# Altium schematic sheet Master.SchDoc: PDM
size A3; SheetNumber: 1; SheetTotal: 6
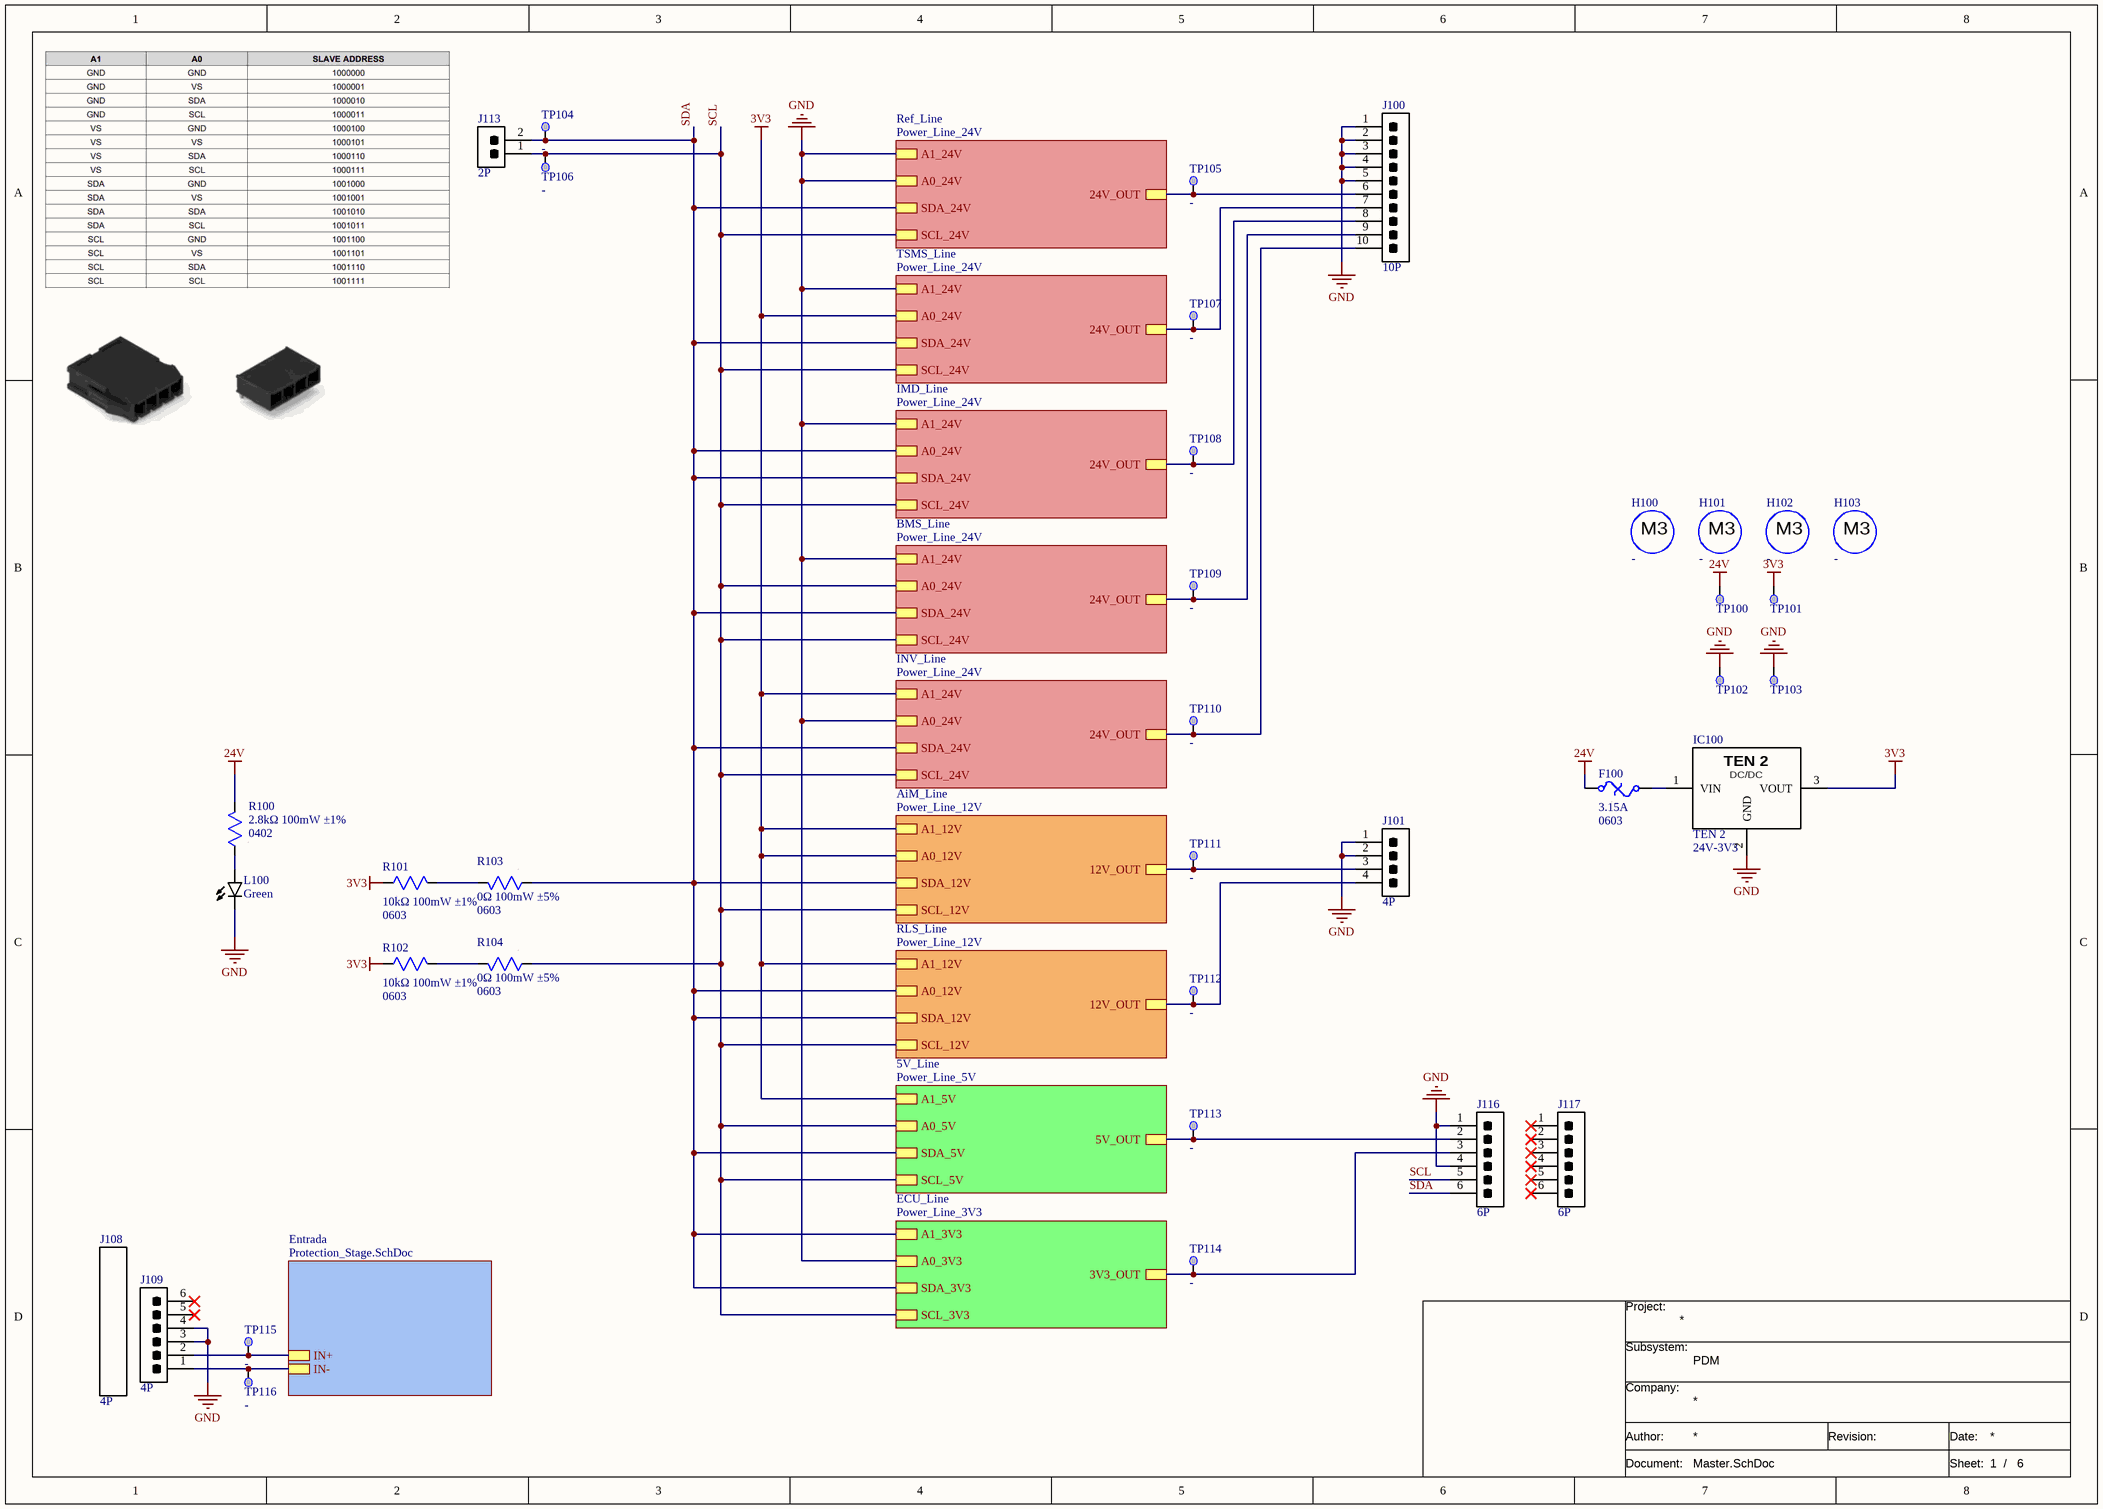
[diagram p0: Master.SchDoc]

## Parts
F100  value 3.15A  Package: 0603  [FUSE SMD 0603]  (hidden comment: FUSE)
H100  SCREW M3  [M3]  (value not drawn)
H101  SCREW M3  [M3]  (value not drawn)
H102  SCREW M3  [M3]  (value not drawn)
H103  SCREW M3  [M3]  (value not drawn)
IC100  TEN 2  value 24V-3V3  [TEN 2]
J100  value 10P  [657010240101]  (hidden comment: CONN 10P)
J101  value 4P  [657004240101]  (hidden comment: CONN 4P)
J108  value 4P  [657004150201]  (hidden comment: AEREO)
J109  value 4P  [657004140101]  (hidden comment: CONN 6P)
J113  value 2P  [PIN_HEADER_THT_2P]  (hidden comment: CONN 2P)
J116  value 6P  [HEADERS_MALE_6P_2.54MM]  (hidden comment: CONN 6P)
J117  value 6P  [HEADERS_MALE_6P_2.54MM]  (hidden comment: CONN 6P)
L100  value Green  [LED SMD 0603]  (hidden comment: LED WHITE)
R100  value 2.8kΩ 100mW ±1%  Package: 0402  [RES SMD 0402]  (hidden comment: RES)
R101  value 10kΩ 100mW ±1%  Package: 0603  [RES SMD 0603]  (hidden comment: RES)
R102  value 10kΩ 100mW ±1%  Package: 0603  [RES SMD 0603]  (hidden comment: RES)
R103  value 0Ω 100mW ±5%  Package: 0603  [RES SMD 0603]  (hidden comment: RES)
R104  value 0Ω 100mW ±5%  Package: 0603  [RES SMD 0603]  (hidden comment: RES)
TP100  Test Point  [TP_THT_1.5MM]  (value not drawn)  (no BOM)
TP101  Test Point  [TP_THT_1.5MM]  (value not drawn)  (no BOM)
TP102  Test Point  [TP_THT_1.5MM]  (value not drawn)  (no BOM)
TP103  Test Point  [TP_THT_1.5MM]  (value not drawn)  (no BOM)
TP104  Test Point  [TP_SMD_1MM]  (value not drawn)  (no BOM)
TP105  Test Point  [TP_SMD_1MM]  (value not drawn)  (no BOM)
TP106  Test Point  [TP_SMD_1MM]  (value not drawn)  (no BOM)
TP107  Test Point  [TP_SMD_1MM]  (value not drawn)  (no BOM)
TP108  Test Point  [TP_SMD_1MM]  (value not drawn)  (no BOM)
TP109  Test Point  [TP_SMD_1MM]  (value not drawn)  (no BOM)
TP110  Test Point  [TP_SMD_1MM]  (value not drawn)  (no BOM)
TP111  Test Point  [TP_SMD_1MM]  (value not drawn)  (no BOM)
TP112  Test Point  [TP_SMD_1MM]  (value not drawn)  (no BOM)
TP113  Test Point  [TP_SMD_1MM]  (value not drawn)  (no BOM)
TP114  Test Point  [TP_SMD_1MM]  (value not drawn)  (no BOM)
TP115  Test Point  [TP_SMD_1MM]  (value not drawn)  (no BOM)
TP116  Test Point  [TP_SMD_1MM]  (value not drawn)  (no BOM)

## Sub-sheets
5V_Line = Power_Line_5V: 5V_OUT, A1_5V, A0_5V, SDA_5V, SCL_5V
AiM_Line = Power_Line_12V: 12V_OUT, A1_12V, A0_12V, SDA_12V, SCL_12V
BMS_Line = Power_Line_24V: A1_24V, A0_24V, SDA_24V, SCL_24V, 24V_OUT
ECU_Line = Power_Line_3V3: 3V3_OUT, A1_3V3, A0_3V3, SDA_3V3, SCL_3V3
Entrada = Protection_Stage.SchDoc: IN-, IN+
IMD_Line = Power_Line_24V: A1_24V, A0_24V, SDA_24V, SCL_24V, 24V_OUT
INV_Line = Power_Line_24V: A1_24V, A0_24V, SDA_24V, SCL_24V, 24V_OUT
Ref_Line = Power_Line_24V: A1_24V, A0_24V, SDA_24V, SCL_24V, 24V_OUT
RLS_Line = Power_Line_12V: 12V_OUT, A1_12V, A0_12V, SDA_12V, SCL_12V
TSMS_Line = Power_Line_24V: A1_24V, A0_24V, SDA_24V, SCL_24V, 24V_OUT

## Nets
3V3: IC100.3(VOUT) R101.1 R102.1 TP101.1 ; sheet 5V_Line/A1_5V, sheet RLS_Line/A1_12V, sheet AiM_Line/A1_12V, sheet AiM_Line/A0_12V, sheet INV_Line/A1_24V, sheet TSMS_Line/A0_24V
24V: F100.1 R100.2 TP100.1
GND: IC100.2(GND) J100.1 J100.2 J100.3 J100.4 J100.5 J101.1 J101.2 J109.3 J109.4 J116.1 J116.4 L100.C TP102.1 TP103.1 ; sheet ECU_Line/A0_3V3, sheet Ref_Line/A1_24V, sheet Ref_Line/A0_24V, sheet IMD_Line/A1_24V, sheet BMS_Line/A1_24V, sheet INV_Line/A0_24V, sheet TSMS_Line/A1_24V
SCL: J113.1 J116.5 R104.1 TP106.1 ; sheet ECU_Line/SCL_3V3, sheet 5V_Line/A0_5V, sheet 5V_Line/SCL_5V, sheet RLS_Line/SCL_12V, sheet AiM_Line/SCL_12V, sheet Ref_Line/SCL_24V, sheet IMD_Line/SCL_24V, sheet BMS_Line/A0_24V, sheet BMS_Line/SCL_24V, sheet INV_Line/SCL_24V, sheet TSMS_Line/SCL_24V
SDA: J113.2 J116.6 R103.1 TP104.1 ; sheet ECU_Line/A1_3V3, sheet ECU_Line/SDA_3V3, sheet 5V_Line/SDA_5V, sheet RLS_Line/A0_12V, sheet RLS_Line/SDA_12V, sheet AiM_Line/SDA_12V, sheet Ref_Line/SDA_24V, sheet IMD_Line/A0_24V, sheet IMD_Line/SDA_24V, sheet BMS_Line/SDA_24V, sheet INV_Line/SDA_24V, sheet TSMS_Line/SDA_24V
NetF100_2: F100.2 IC100.1(VIN)
NetJ100_6: J100.6 TP105.1 ; sheet Ref_Line/24V_OUT
NetJ100_7: J100.7 TP107.1 ; sheet TSMS_Line/24V_OUT
NetJ100_8: J100.8 TP108.1 ; sheet IMD_Line/24V_OUT
NetJ100_9: J100.9 TP109.1 ; sheet BMS_Line/24V_OUT
NetJ100_10: J100.10 TP110.1 ; sheet INV_Line/24V_OUT
NetJ101_3: J101.3 TP111.1 ; sheet AiM_Line/12V_OUT
NetJ101_4: J101.4 TP112.1 ; sheet RLS_Line/12V_OUT
NetJ109_1: J109.1 TP116.1 ; sheet Entrada/IN-
NetJ109_2: J109.2 TP115.1 ; sheet Entrada/IN+
NetJ116_2: J116.2 TP113.1 ; sheet 5V_Line/5V_OUT
NetJ116_3: J116.3 TP114.1 ; sheet ECU_Line/3V3_OUT
NetL100_A: L100.A R100.1
NetR101_2: R101.2 R103.2
NetR102_2: R102.2 R104.2

Not connected (* = marked no-connect by the designer): J109 5* 6*; J117 1* 2* 3* 4* 5* 6*

## Notes on the sheet
- Project:
- Subsystem:
- Company:
- Document:
- Author:
- Revision:
- Date:
- Sheet:
- /
- (in symbol 070-0001) DC/DC
- (in symbol 100-0002) M3

## Library data of the parts
F100 = 040-0025: Surface Mount Fuses 3.15A Slow Blow 0603 SinglFuse; MPN: SF-0603S315-2; Manufacturer: Bourns; ComponentLink1Description: Datasheet; ComponentLink1URL: https://www.mouser.es/datasheet/3/40/1/sf0603s.pdf; ComponentLink2Description: Distributor Link; ComponentLink2URL: https://www.mouser.es/en/ProductDetail/Bourns/SF-0603S315-2?qs=GIQXYiEeHGBW8r%252BkbDjk9Q%3D%3D; ID: 040-0025; Distributor PN: 652-SF-0603S315-2; Distributor: Mouser
H100-H103 = 100-0002: M3 Screw; ComponentLink1Description: Datasheet; ComponentLink1URL: -; ComponentLink2Description: Distributor Link; ComponentLink2URL: -; ID: 100-0002; Value: -; Package: -; MPN: -; Manufacturer: -; Distributor PN: -; Distributor: -
IC100 = 070-0001: Convertidores DC/DC para montaje pasante 4.75-36Vin 3.3V 2A switching regulator; MPN: TSR 2-2433; Manufacturer: TRACO Power; ComponentLink1Description: Datasheet; ComponentLink1URL: https://www.tracopower.com/tsr2-datasheet; ComponentLink2Description: Distributor Link; ComponentLink2URL: https://www.mouser.es/ProductDetail/TRACO-Power/TSR-2-2433?qs=NtE2QagKf6Qer8edccxn%2FA%3D%3D; ID: 070-0001; Package: 14.0x7.5x10.1mm; Distributor PN: 495-TSR2-2433; Distributor: Mouser
J100 = 110-0069: Headers & Wire Housings WR-MPC5 THT Dual Row Male Header Right Angled with Snap-in Plastic Pegs Glow-Wire 10 Pins; Manufacturer: Wurth Elektronik; ComponentLink1Description: Datasheet; ComponentLink1URL: https://www.we-online.com/components/products/datasheet/657010240101.pdf; ComponentLink2Description: Distributor Link; ComponentLink2URL: https://www.mouser.es/en/ProductDetail/Wurth-Elektronik/657010240101?qs=Z%252BL2brAPG1L7pimSXLZIOg%3D%3D; ID: 110-0069; Package: THT 5,7mm; MPN: 657010240101; Distributor PN: 710-657010240101; Distributor: Mouser
J101 = 110-0070: Headers & Wire Housings WR-MPC5 THT Dual Row Male Header Right Angled with Snap-in Plastic Pegs Glow-Wire 4 Pins; Manufacturer: Wurth Elektronik; ComponentLink1Description: Datasheet; ComponentLink1URL: https://www.we-online.com/components/products/datasheet/657004240101.pdf; ComponentLink2Description: Distributor Link; ComponentLink2URL: https://www.mouser.es/en/ProductDetail/Wurth-Elektronik/657004240101?qs=Z%252BL2brAPG1IceqvpwioElw%3D%3D; ID: 110-0070; Package: THT 5,7mm; MPN: 657004240101; Distributor PN: 710-657004240101; Distributor: Mouser
J108 = 110-0060: Receptacle Single Row; Manufacturer: Wurth Elektronik; ComponentLink1Description: Datasheet; ComponentLink1URL: https://www.we-online.com/components/products/datasheet/657004150201.pdf; ComponentLink2Description: Distributor Link; ComponentLink2URL: https://www.we-online.com/en/components/products/WTB_WR_MPC5_RECEPTACLE_PLUG_SINGLE_ROW#/articles/WTB_WR_MPC5_SINGLE_ROW_RECEPTACLE_HOUSING; ID: 110-0060; Package: THT 5,7mm; MPN: 657004150201; Distributor PN: 657004150201; Distributor: Wurth Elektronik
J109 = 110-0059: WR-MPC5 Male Header Single Row; Manufacturer: Wurth Elektronik; ComponentLink1Description: Datasheet; ComponentLink1URL: https://www.we-online.com/components/products/datasheet/657004140101.pdf; ComponentLink2Description: Distributor Link; ComponentLink2URL: https://www.we-online.com/en/components/products/WTB_WR_MPC5_SINGLE_ROW; ID: 110-0059; Package: THT 5,7mm; MPN: 657004140101; Distributor PN: 657004140101; Distributor: Wurth Elektronik
J113 = 110-0061: Alojamientos de cables y cabecera 2.54MM HIGH TEMP PCB HDR STRIP; MPN: HTSW-102-07-G-S; Manufacturer: Samtec; ComponentLink1Description: Datasheet; ComponentLink1URL: https://www.mouser.es/datasheet/3/85/1/htsw_th.pdf; ComponentLink2Description: Distributor Link; ComponentLink2URL: https://www.mouser.es/ProductDetail/Samtec/HTSW-102-07-G-S?qs=FESYatJ8odI1BCBanfu%2FIg%3D%3D; ID: 110-0061; Package: THT 2,54mm; Distributor PN: 200-HTSW10207GS; Distributor: Mouser
J116 J117 = 110-0050: Pin Header 6 Position 2.54mm Pitch Single Row Through Hole -55℃~+105℃; MPN: 2541WV-06P; Manufacturer: HanElectricity; ComponentLink1Description: Datasheet; ComponentLink1URL: https://www.lcsc.com/datasheet/C5383115.pdf; ComponentLink2Description: Distributor Link; ComponentLink2URL: https://www.lcsc.com/product-detail/C5383115.html; ID: 110-0050; Package: THT 2,54mm; Distributor PN: C5383115; Distributor: LCSC
L100 = 033-0023: LED de un solo color Green 525nm 1400mcd 2.85V 73deg 0603; MPN: VLMTG1400-GS08; Manufacturer: Vishay Semiconductors; ComponentLink1Description: Datasheet; ComponentLink1URL: https://www.vishay.com/docs/84393/vlmtg1400.pdf; ComponentLink2Description: Distributor Link; ComponentLink2URL: https://www.mouser.es/ProductDetail/Vishay-Semiconductors/VLMTG1400-GS08?qs=gt1LBUVyoHlZ6yHd8iEIzQ%3D%3D; ID: 033-0023; Package: 0603; Distributor PN: 78-VLMTG1400-GS08; Distributor: Mouser
R100 = 010-0171: Resistores de película gruesa - SMD WRIS-RSKS 28 kOhms 1 % 0.1 W 0402 AEC-Q200; MPN: 560112110228; Manufacturer: Wurth Elektronik; ComponentLink1Description: Datasheet; ComponentLink1URL: https://www.we-online.com/components/products/datasheet/560112110228.pdf; ComponentLink2Description: Distributor Link; ComponentLink2URL: https://www.mouser.es/ProductDetail/Wurth-Elektronik/560112110228?qs=mELouGlnn3ckGB3GQT9Puw%3D%3D; ID: 010-0171; Distributor PN: 710-560112110228; Distributor: Mouser
R101 R102 = 010-0145: Resistores de película gruesa - SMD WRIS-RSKS 10 kOhms 1 % 0.1 W 0603 AEC-Q200; MPN: 560112116005; Manufacturer: Wurth Elektronik; ComponentLink1Description: Datasheet; ComponentLink1URL: https://www.we-online.com/components/products/datasheet/560112116005.pdf; ComponentLink2Description: Distributor Link; ComponentLink2URL: https://www.mouser.es/ProductDetail/Wurth-Elektronik/560112116005?qs=mELouGlnn3dMVSPHwBGouA%3D%3D; ID: 010-0145; Distributor PN: 710-560112116005; Distributor: Mouser
R103 R104 = 010-0142: Resistores de película gruesa - SMD WRIS-RSKS <0.05 Ohms 0.1 W Jumper 0603 AEC-Q200; MPN: 560112116001; Manufacturer: Wurth Elektronik; ComponentLink1Description: Datasheet; ComponentLink1URL: https://www.we-online.com/components/products/datasheet/560112116001.pdf; ComponentLink2Description: Distributor Link; ComponentLink2URL: https://www.mouser.es/ProductDetail/Wurth-Elektronik/560112116001?qs=mELouGlnn3dlnHYj7TecuA%3D%3D; ID: 010-0142; Distributor PN: 710-560112116001; Distributor: Mouser
TP100-TP103 = 110-0039: Test Point 1.5mm THT; ComponentLink1URL: -; ComponentLink1Description: Datasheet; ComponentLink1URL: *; ComponentLink2Description: Distributor Link; ComponentLink2URL: -; ID: 110-0039; Value: 1.5mm; Package: -; MPN: -; Manufacturer: -; Distributor PN: -; Distributor: -
TP104-TP116 = 110-0007: ComponentLink1URL: -; ComponentLink1Description: Datasheet; ComponentLink1URL: *; ComponentLink2Description: Distributor Link; ComponentLink2URL: -; ID: 110-0007; Value: -; Package: -; MPN: -; Manufacturer: -; Distributor PN: -; Distributor: -